# Altium schematic sheet Connectors.SchDoc: Connectors
size A4; DocumentNumber: 10; Revision: 0v1; SheetNumber: 10; SheetTotal: 10
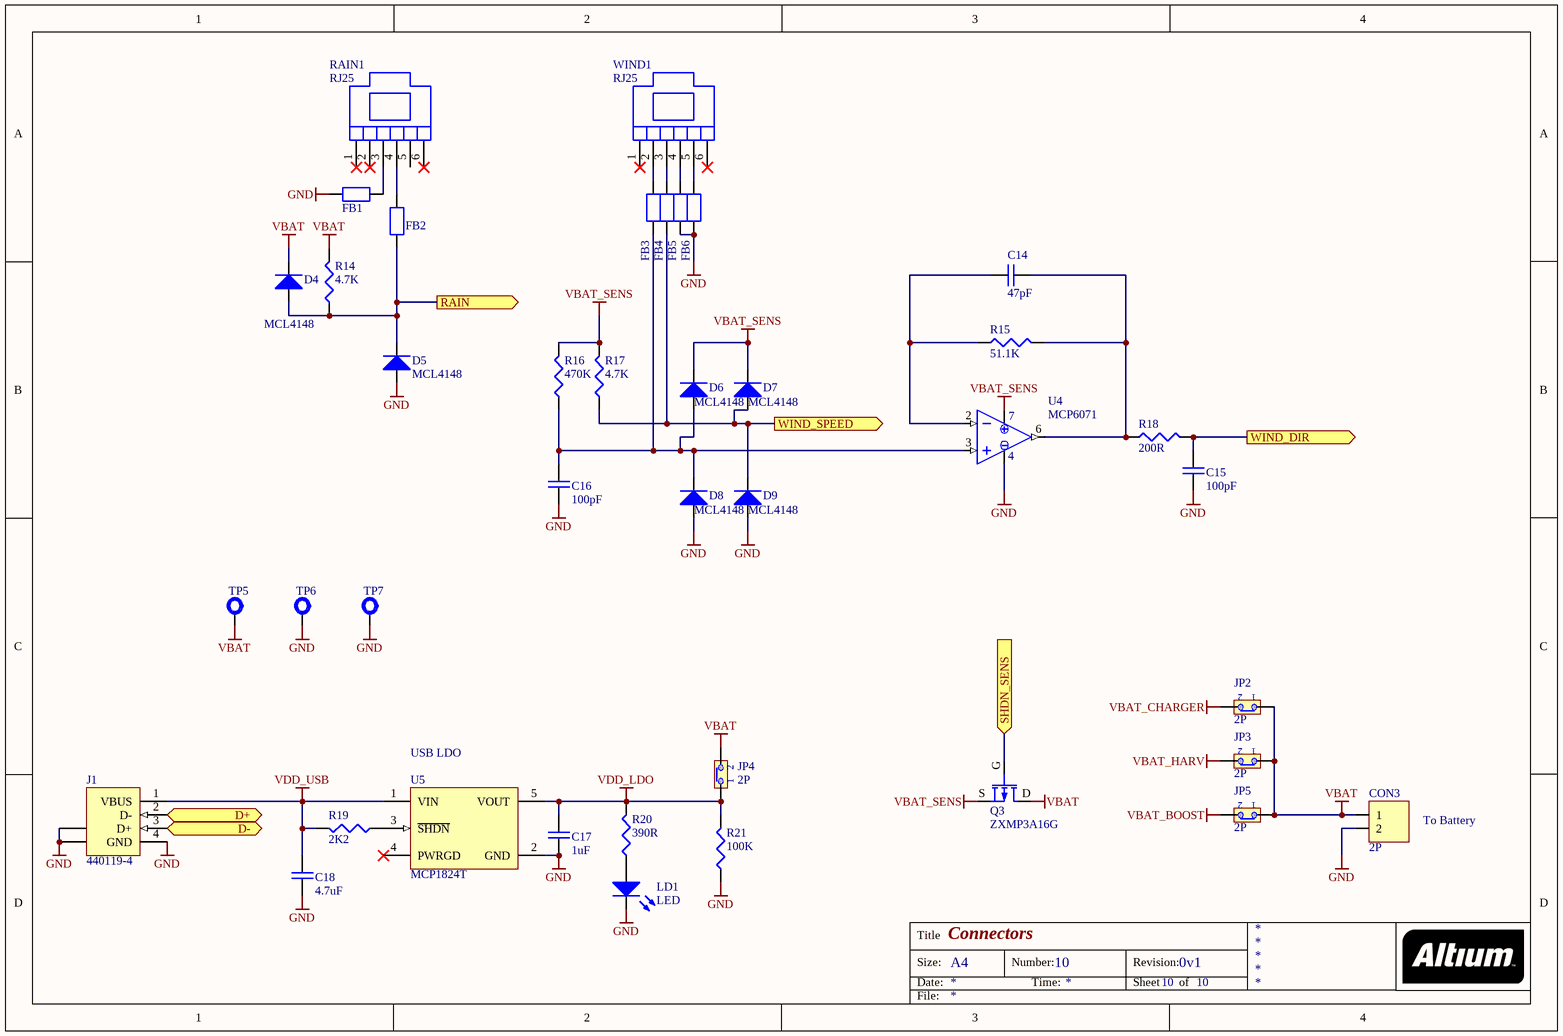
[diagram p0: Connectors.SchDoc]

## Parts
C14  47pF  [0603]
C15  100pF  [0603]
C16  100pF  [0603]
C17  1uF  [0805]
C18  4.7uF  [0805]
CON3  2P  [INTERLOCK2-5MM-FIXED]
D4  MCL4148  [0805@DIODE]
D5  MCL4148  [0805@DIODE]
D6  MCL4148  [0805@DIODE]
D7  MCL4148  [0805@DIODE]
D8  MCL4148  [0805@DIODE]
D9  MCL4148  [0805@DIODE]
FB1  150Z_100MHz  [1806]  (value not drawn)
FB2  150Z_100MHz  [1806]  (value not drawn)
FB3  150Z_100MHz  [1806]  (value not drawn)
FB4  150Z_100MHz  [1806]  (value not drawn)
FB5  150Z_100MHz  [1806]  (value not drawn)
FB6  150Z_100MHz  [1806]  (value not drawn)
J1  440119-4  [440119]
JP2  2P  [SIP-2]
JP3  2P  [SIP-2]
JP4  2P  [SIP-2]
JP5  2P  [SIP-2]
LD1  LED  [0805@DIODE]
Q3  ZXMP3A16G  [SOT-223@GDSD]
R14  4.7K  [0603]
R15  51.1K  [0603]
R16  470K  [0603]
R17  4.7K  [0603]
R18  200R  [0603]
R19  2K2  [0603]
R20  390R  [0603]
R21  100K  [0603]
RAIN1  RJ25  [RJ25]
TP5  Test Point  [TERMINAL]  (value not drawn)  (no BOM)
TP6  Test Point  [TEST-PROBE2]  (value not drawn)  (no BOM)
TP7  Test Point  [TERMINAL]  (value not drawn)  (no BOM)
U4  MCP6071  [SOIC-8]
U5  MCP1824T  [SOT-23-5]
WIND1  RJ25  [RJ25]

## Ports
D+ (bidir), D- (bidir), RAIN (out), SHDN_SENS (in), WIND_DIR (out), WIND_SPEED (out)

## Nets
GND: C15.1 C16.1 C17.1 C18.1 CON3.2 D5.A D8.A D9.A FB1.1 FB5.2 FB6.2 J1.4(GND) J1.5(SHLD) J1.6(SHLD) LD1.K R21.1 TP6.1(TP) TP7.1(TP) U4.4(VSS) U5.2(GND)
VBAT: CON3.1 D4.K JP2.1 JP3.1 JP4.2 JP5.1 Q3.D R14.2 TP5.1(TP)
VBAT_BOOST: JP5.2
VBAT_CHARGER: JP2.2
VBAT_HARV: JP3.2
VBAT_SENS: D6.K D7.K Q3.S R16.2 R17.2 U4.7(VDD)
VDD_LDO: C17.2 JP4.1 R20.2 R21.2 U5.5(VOUT)
VDD_USB: C18.2 J1.1(VBUS) R19.2 U5.1(VIN)
D+: J1.2(D-) ; port D+
D-: J1.3(D+) ; port D-
RAIN: D4.A D5.K FB2.1 R14.1 ; port RAIN
SHDN_SENS: Q3.G ; port SHDN_SENS
WIND_DIR: C15.2 R18.2 ; port WIND_DIR
WIND_SPEED: D7.A D9.K FB4.2 R17.1 ; port WIND_SPEED
NetC14_1: C14.1 R15.1 U4.2(INN)
NetC14_2: C14.2 R15.2 R18.1 U4.6(VOUT)
NetC16_2: C16.2 D6.A D8.K FB3.2 R16.1 U4.3(INP)
NetFB1_2: FB1.2 RAIN1.3
NetFB2_2: FB2.2 RAIN1.4
NetFB3_1: FB3.1 WIND1.2
NetFB4_1: FB4.1 WIND1.3
NetFB5_1: FB5.1 WIND1.4
NetFB6_1: FB6.1 WIND1.5
NetLD1_A: LD1.A R20.1
NetR19_1: R19.1 U5.3(~{SHDN})

Not connected (* = marked no-connect by the designer): RAIN1 1* 2* 5 6*; U5 4(PWRGD)*; WIND1 1* 6*

## Notes on the sheet
- (near U5) USB LDO
- To Battery
- Title
- Size:
- Date:
- A4
- Number:
- Time:
- Revision:
- Sheet
- of
- File:

## Library data of the parts
C14-C18 = CAP: Capacitor; Owner: Nuno Brum; Sub-Type: Ceramic; Assembly: INS; Maximum Voltage: *; Creation Date: 2005-04-28; Status: Valid; Validation date: 2006-05-15; Type: Capacitor
CON3 = CON02: Connector 2 pins; Owner: Rui Rebelo; Assembly: INS; Sub-Type: Connector; Creation Date: 2005-05-27; Status: Valid; Validation Date: 2006-05-15; Type: Electrical & Mechanical
D4-D9 = Diode: Vishay Standard Avalanche Sinterglass Diode; Owner: Nuno Brum; Sub-Type: Generic; Assembly: INS; Validation date: 2006-05-15; Creation Date: 2001-06-05; Status: Valid; Model: MCL4148; Type: Diode
FB1-FB6 = FERRITE-BEAD-AXIAL: Ferrite bead; Sub-Type: Filter; Owner: Sergio Pires; Type: Electrical & Mechanical; Assembly: INS; Creation Date: 2005-10-20; Status: New
J1 = 440119-4: USB 1.1, Right Angle, Thru-Hole, B Type, Receptacle, 4 Position, Black; ContactMaterial: Copper Alloy; ContactPlating: Gold (5) over Nickel; TerminationLength: 2.84mm [0.112in.]; PCB_Layout: Complies with manufacturer's recommendation.; DrillSize: Corresponds to nominal value.; PanelGround: Without; Published: 15-Jul-2004; DatasheetDocument: 12-Jan-2004; PackageDocument: 12-Jan-2004; PackageReference: 440119; Publisher: Altium Limited; HousingMaterial: Thermoplastic; ComponentLink1Description: Manufacturer Link; ComponentLink1URL: http://www.tycoelectronics.com/; ComponentLink2Description: Packaging Specification; ComponentLink2URL: http://ecommas.tycoelectronics.com/commerce/DocumentDelivery/DDEController?Action=showdoc&DocId=Customer+Drawing%7F440119%7FC%7Ftif%7FEnglish%7FC_440119_C.tif
JP2-JP5 = JMP2: 2-pin Jumper; Owner: Nuno Brum; Sub-Type: Connector; STATE1: 1; Assembly: INS; Validation Date: 2006-05-15; Creation Date: 2002-07-17; Status: Valid; Type: Electrical & Mechanical
LD1 = LED: Light emitting diode; Owner: Nuno Brum; Assembly: INS; Creation Date: 2001-06-05; Sub-Type: LED; Status: Valid; Validation date: 2006-05-15; Model: LED; Type: Diode
Q3 = MOSFET-P: P-Channel Logic Level Enhancement Mode Field Effect Transistor; Owner: Nuno Brum; Sub-Type: MOSFET; Assembly: INS; Validation date: 2006-05-15; Creation Date: 2001-06-05; Status: Valid; Model: ZXMP3A16G; Type: Transistor
R14-R21 = RES: Resistor; Owner: Nuno Brum; Sub-Type: Generic; Assembly: INS; Validation date: 2006-05-15; Creation Date: 2002-07-17; Status: Valid; Power: *; Type: Resistor
RAIN1 WIND1 = RJ25: RJ25 Connector; Type: Connector; Creation Date: 2012-03-26
TP5-TP7 = TEST-PROBE: Test/Probe Point; Owner: Nuno Brum; Sub-Type: Mechanical; Assembly: PCB; Validation Date: 2006-05-15; Type: PCB; Creation Date: 2005-06-01; Status: Valid
U4 = MCP6V26: Low-Offset Opamp; Type: IC; Creation Date: 2012-03-15
U5 = MCP1824T: 300 mA, Low Voltage, Low Quiescent Current LDO Regulator, 5-Pin SOT-23, Extended Temperature, Tape and Reel; Published: 29-Jan-2009; DatasheetVersion: revA, Aug-2007; PackageVersion: revBB, Aug-2009; PackageReference: SOT-23-OT5; Publisher: Altium Limited; PackageDescription: 5-Lead Plastic Small Outline Transistor (OT) [SOT-23]; Supplier 1: Digi-Key; Supplier Part Number 1: MCP1824T-3302E/OTTR-ND; Supplier 2: Digi-Key; Supplier Part Number 2: MCP1824T-3302E/OTCT-ND; Supplier 3: Digi-Key; Supplier Part Number 3: MCP1824T-3302E/OTDKR-ND; Supplier 4: Farnell; Supplier Part Number 4: 1578387; Code_IPC: SOT23-5; ComponentLink1Description: Datasheet; ComponentLink1URL: http://ww1.microchip.com/downloads/en/DeviceDoc/22070a.pdf; ComponentLink2Description: Packaging Specification; ComponentLink2URL: http://www.microchip.com/stellent/groups/techpub_sg/documents/packagingspec/en012702.pdf; ComponentLink3Description: Microchip.com Home; ComponentLink3URL: http://www.microchip.com/